# EasyEDA Pro project motorko_cryo_drake.eprj, schematic Schematic1

## Sheets
1 main: Board Name: Board1; Create Date: 2026-01-02; Page Name: main; Project Name: motorko_azure_dragon; Schematic Name: Schematic1; Update Date: 2026-01-03; Company: EasyEDA.com; Page Size: A4; Version: V1.0
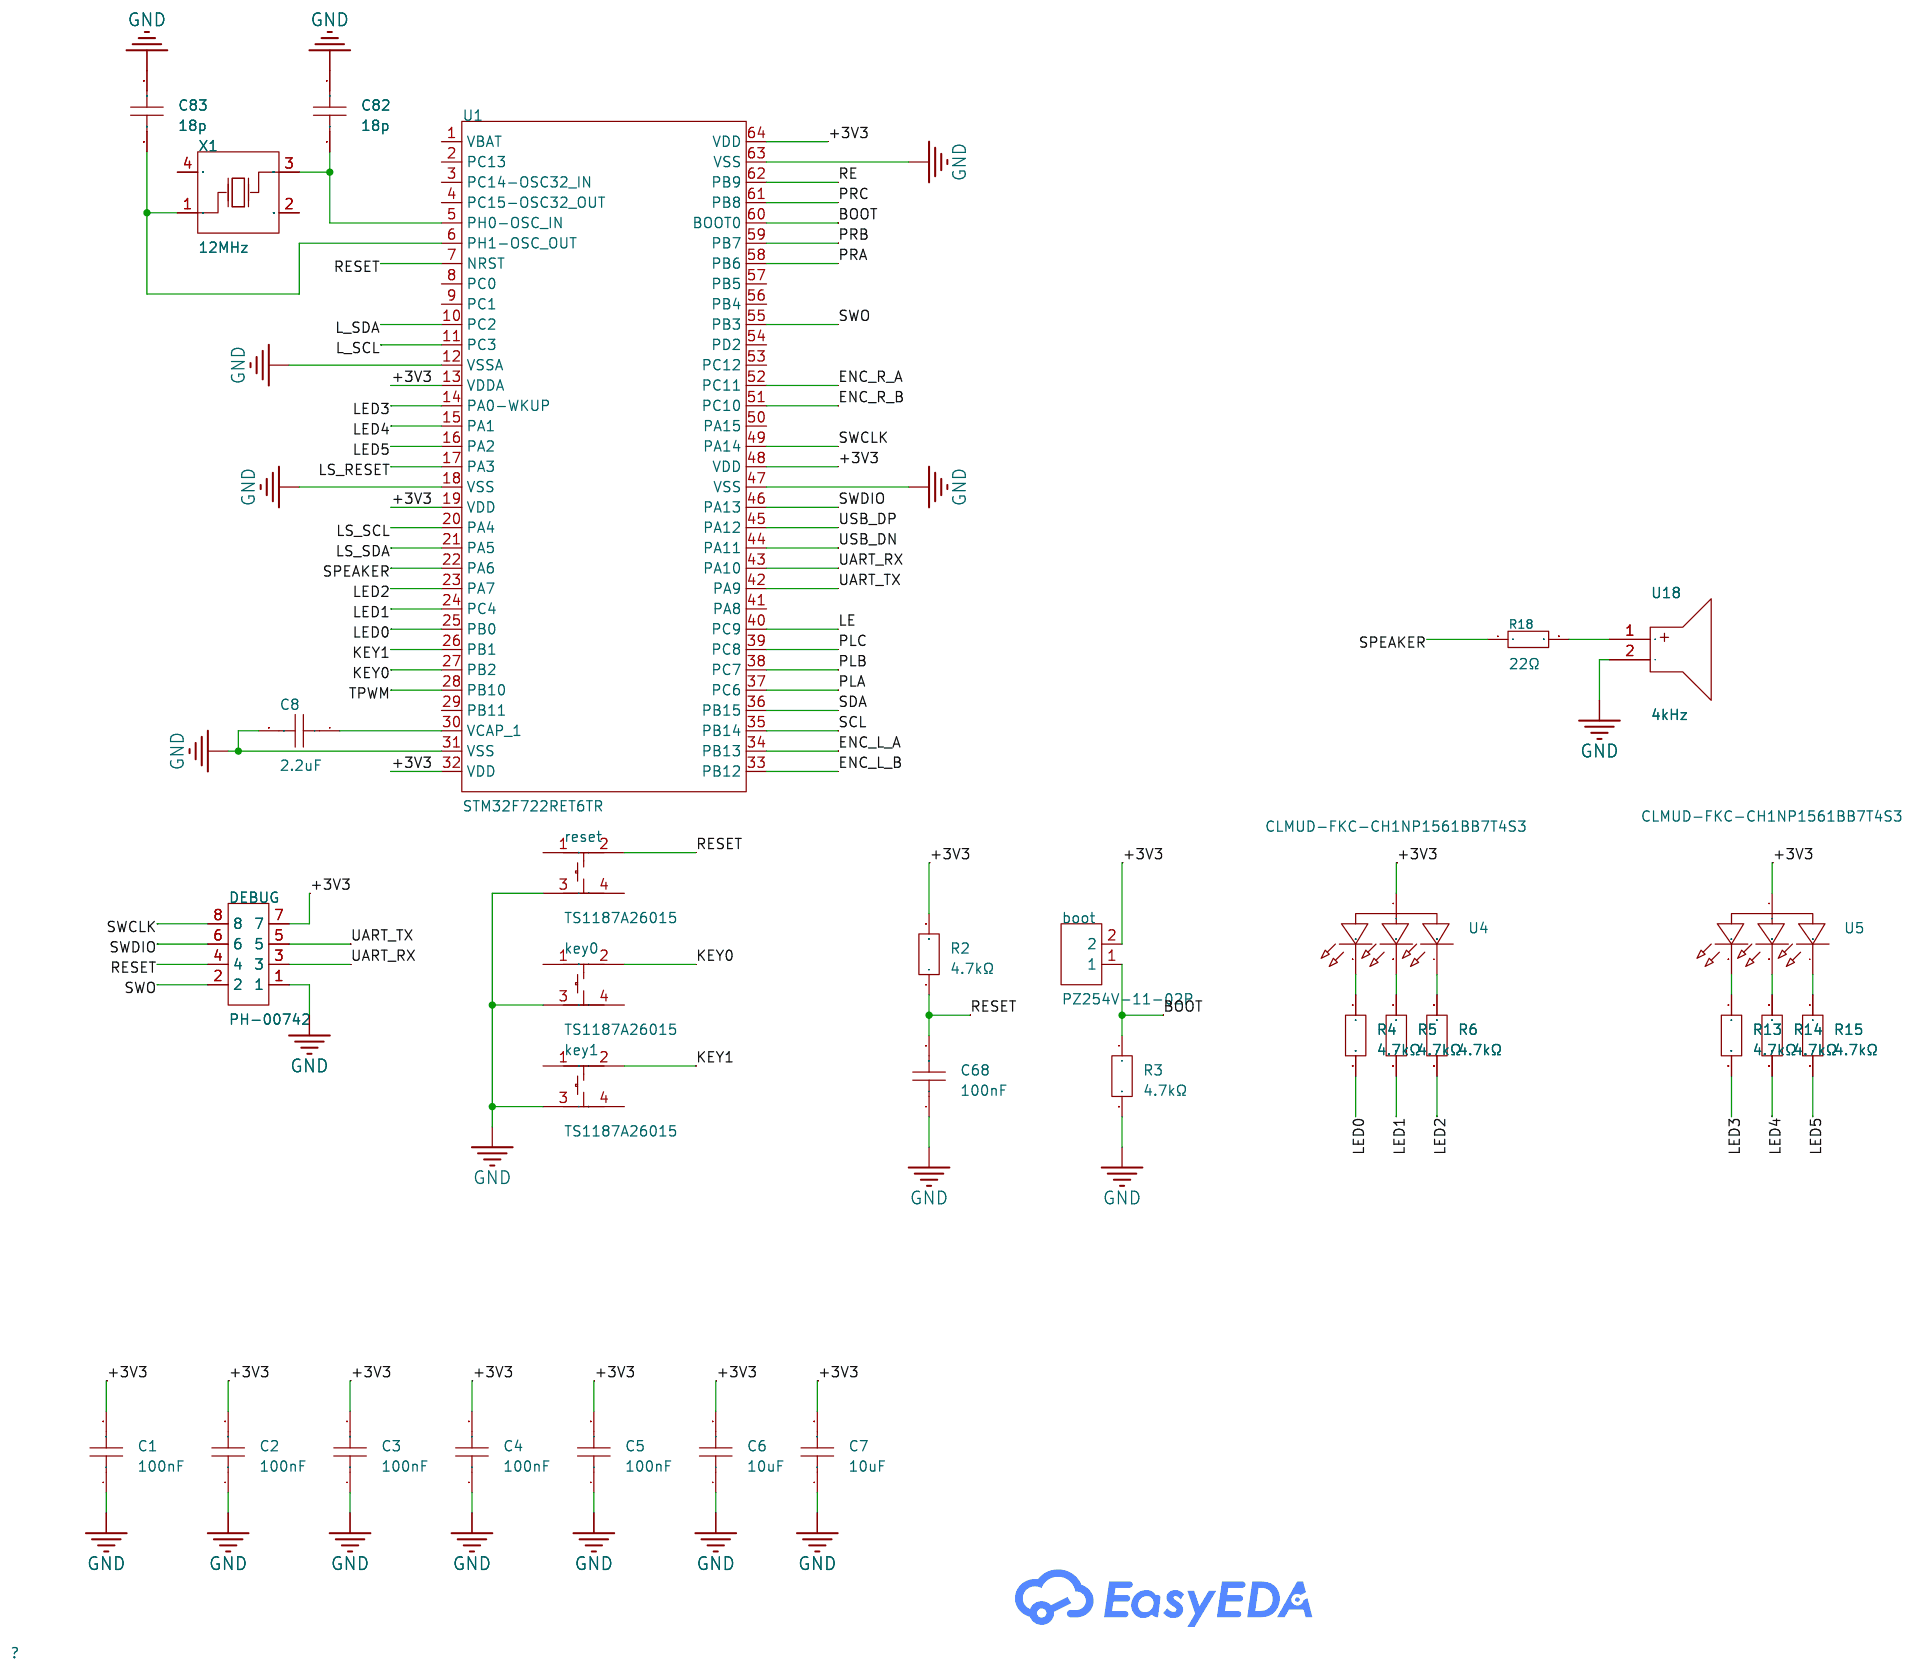
[diagram p0: main]
2 motors: Page Name: motors; Update Date: 2026-01-02
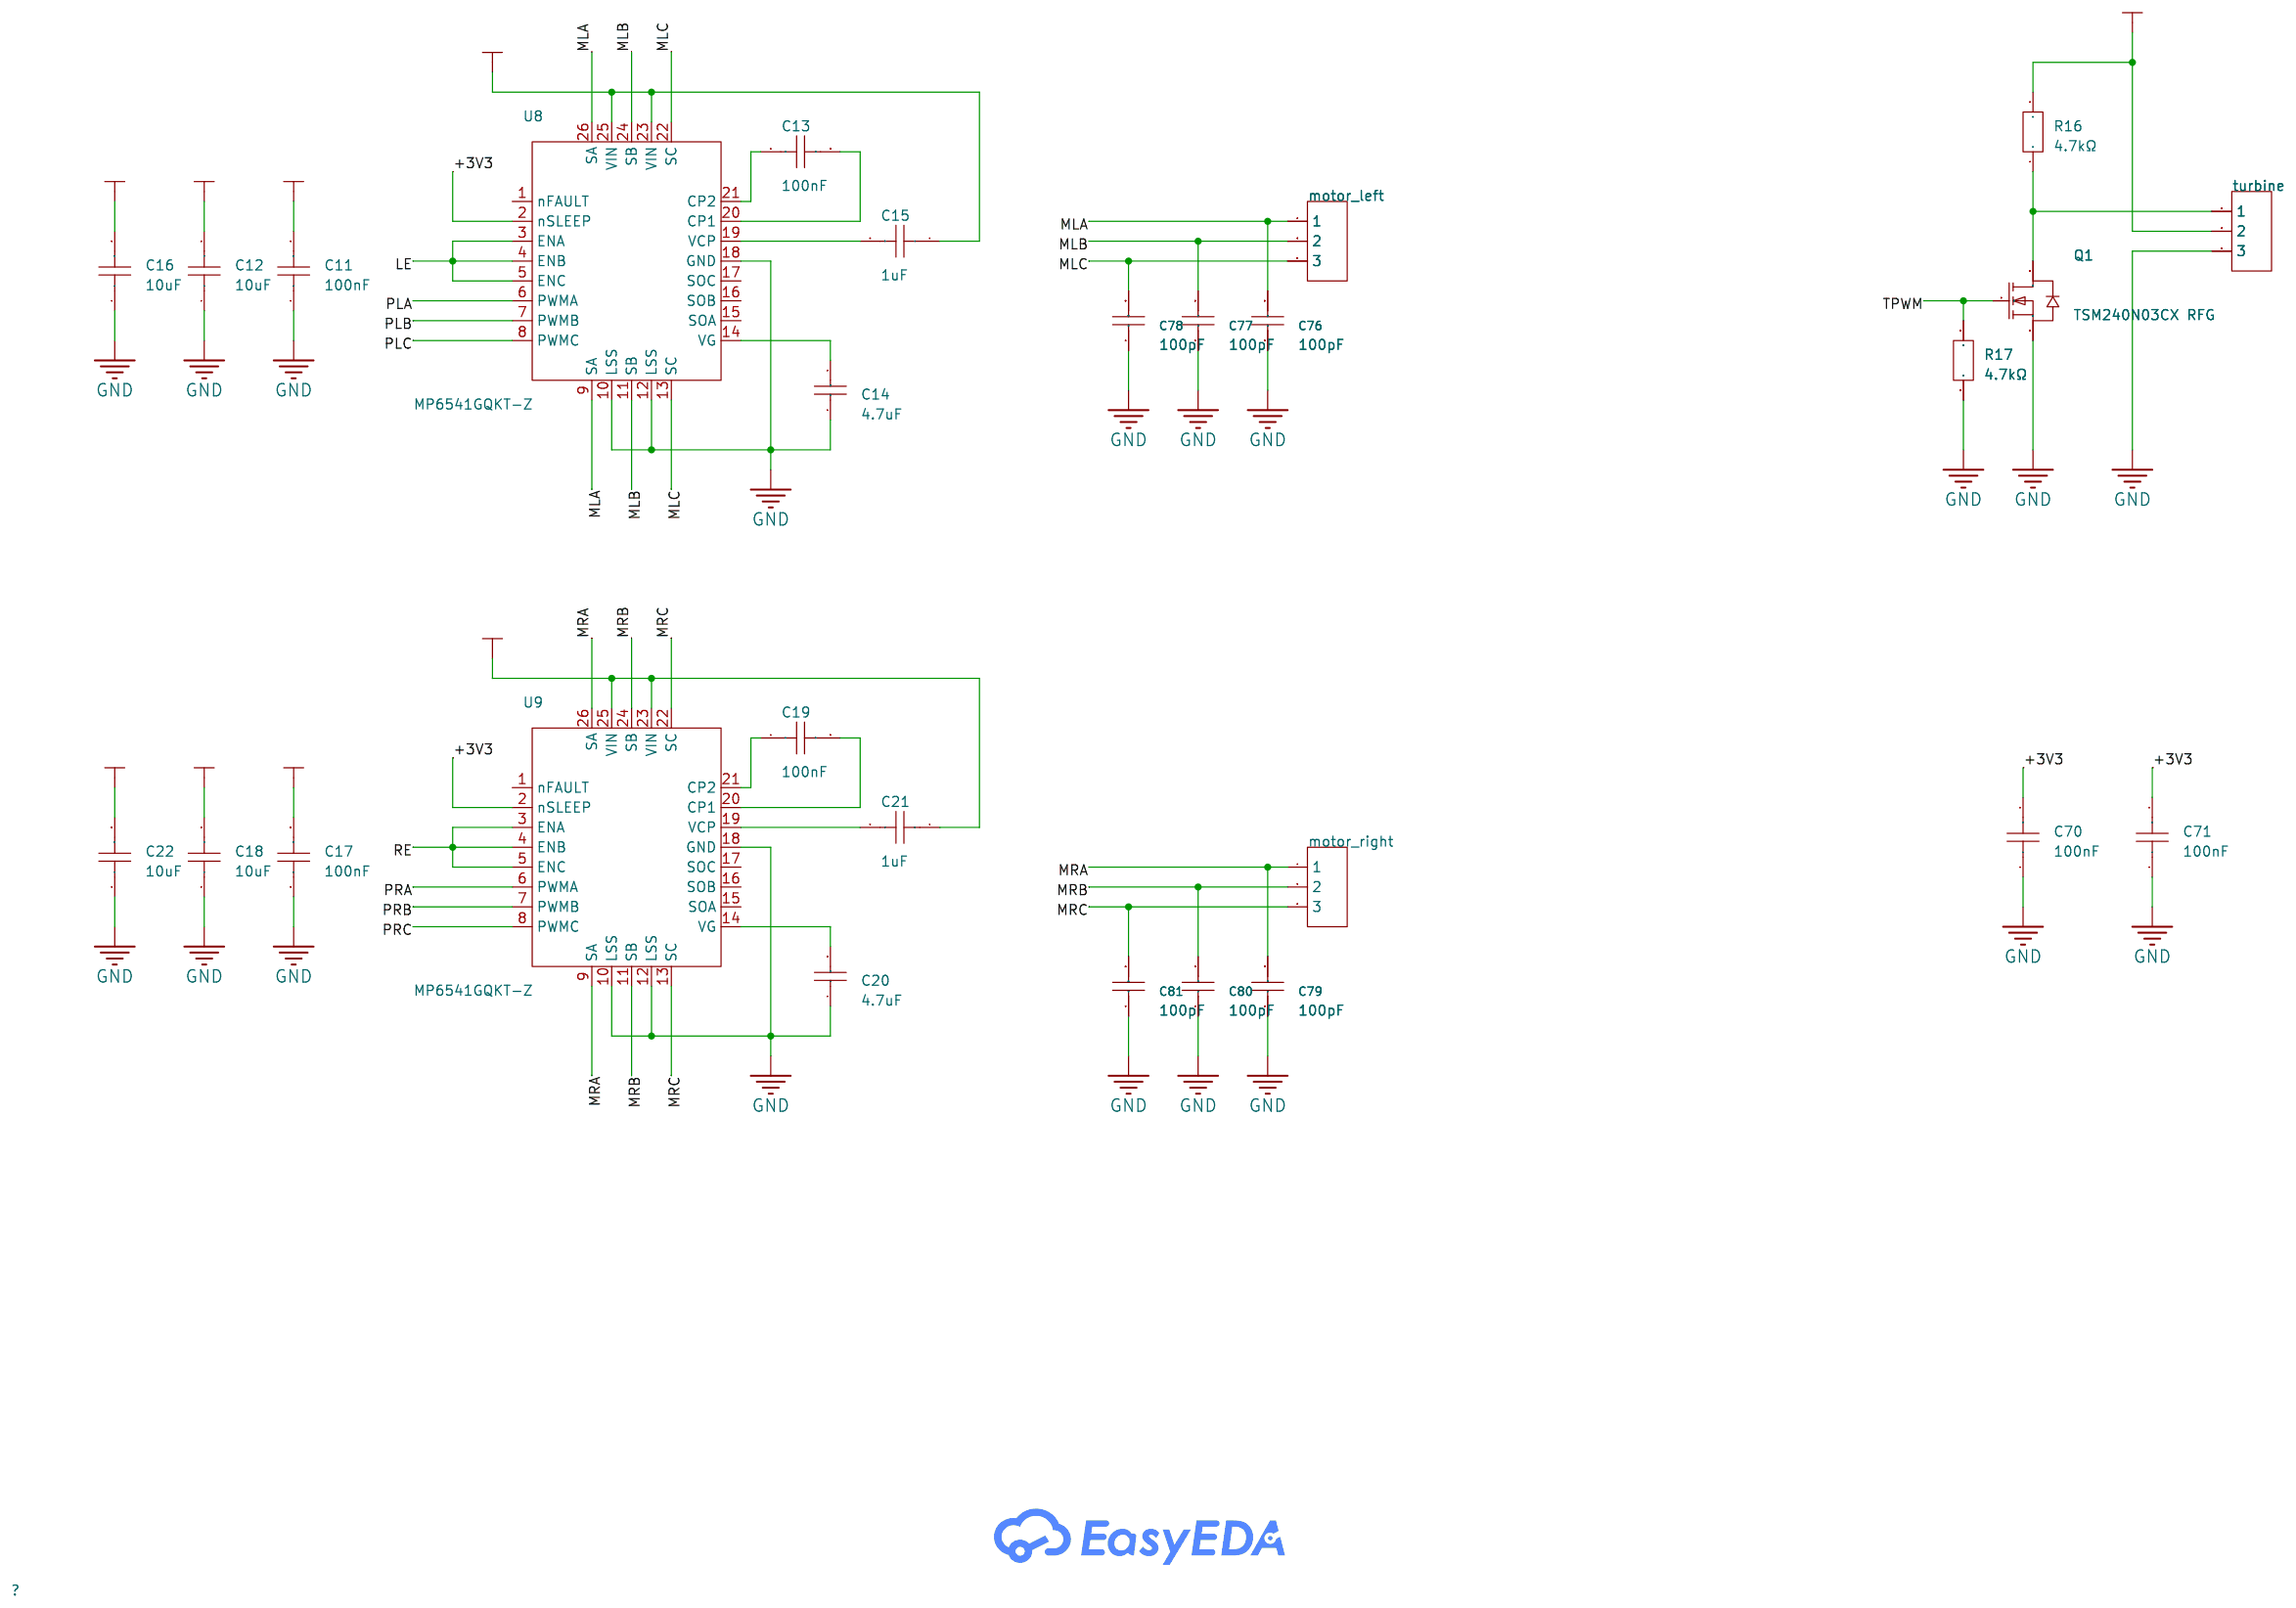
[diagram p1: motors]
3 power: Page Name: power
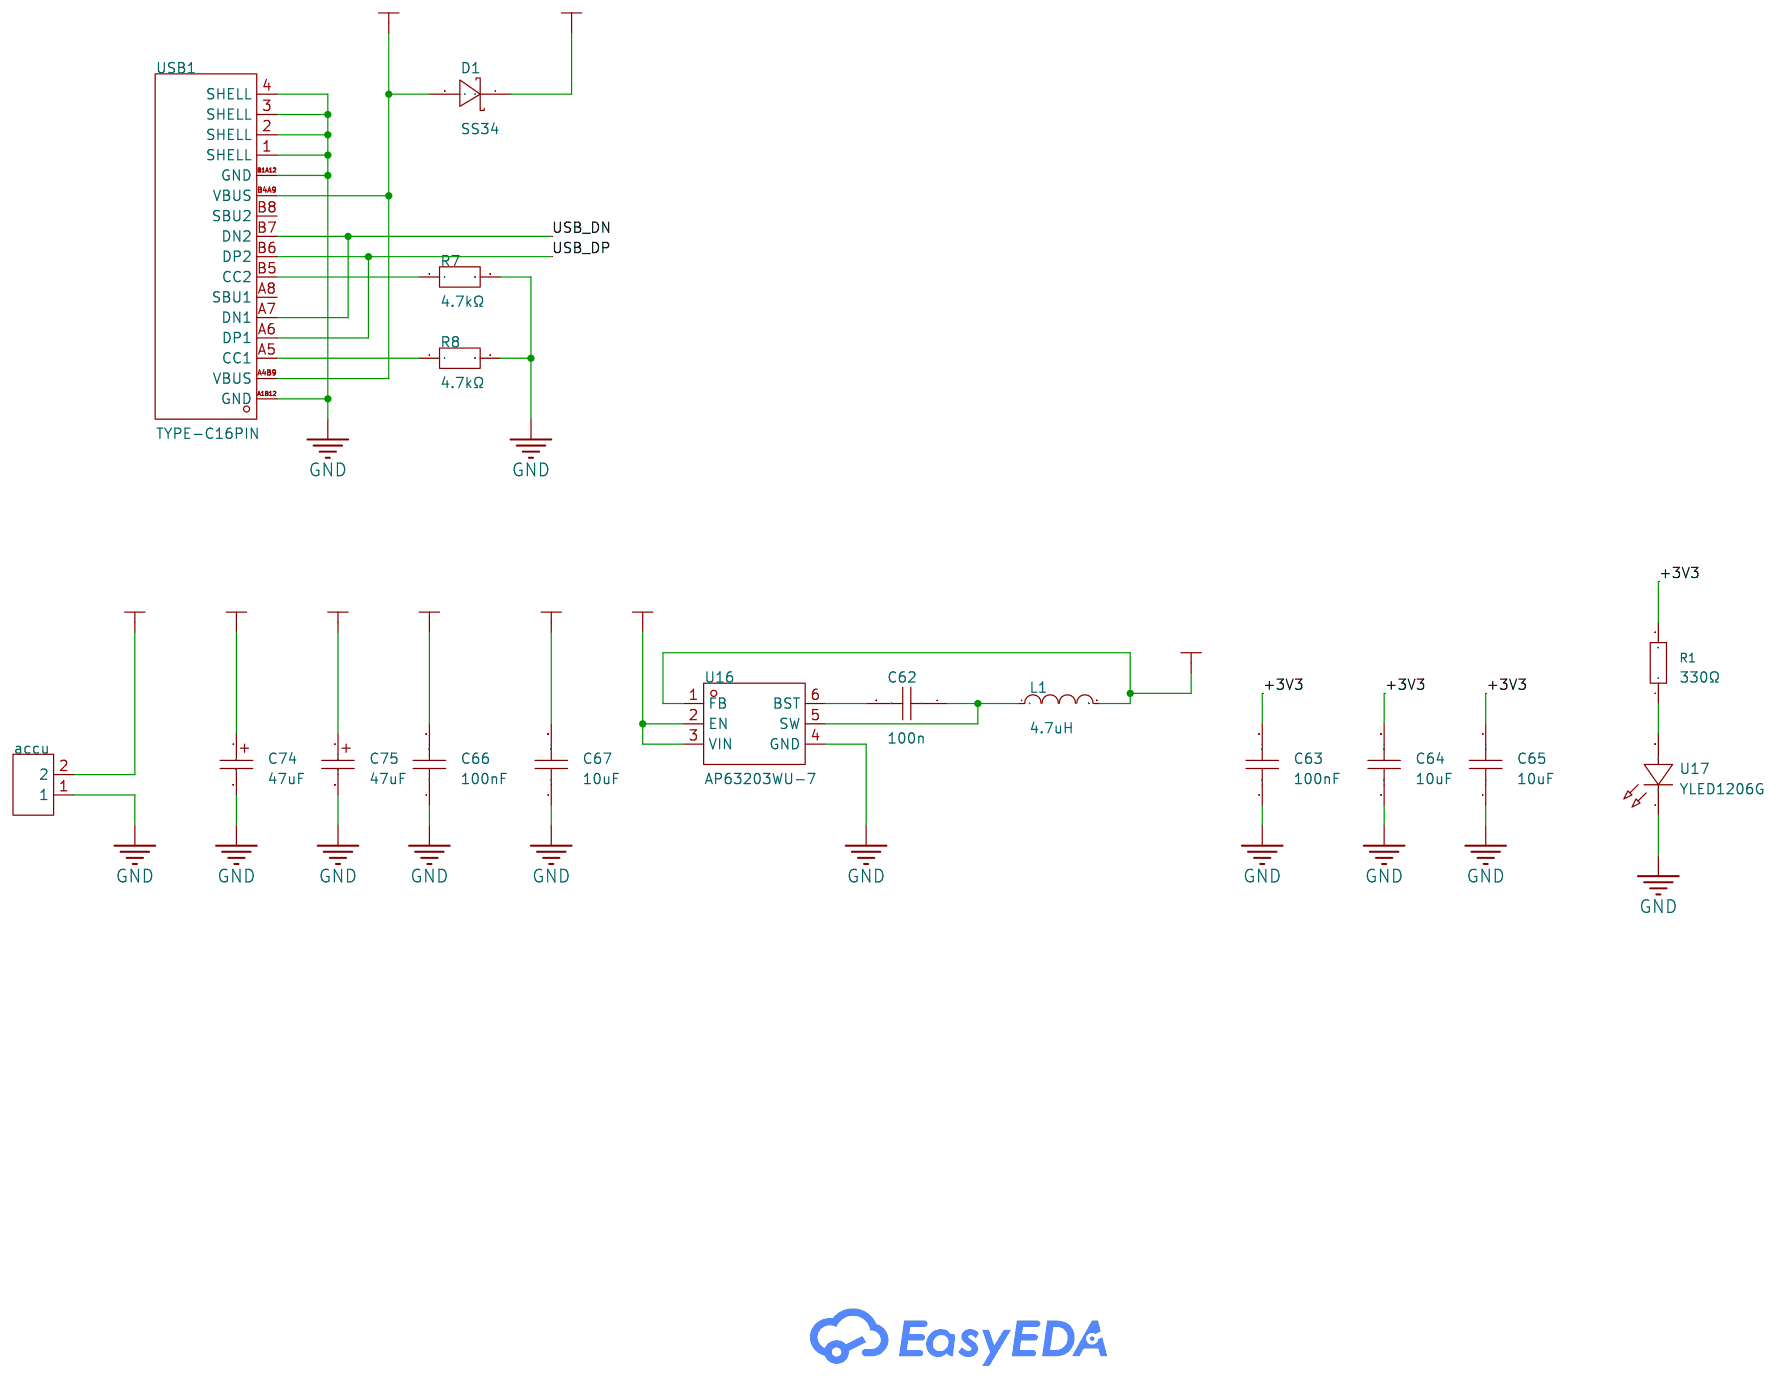
[diagram p2: power]
4 sensors: Create Date: 2026-01-03; Page Name: sensors
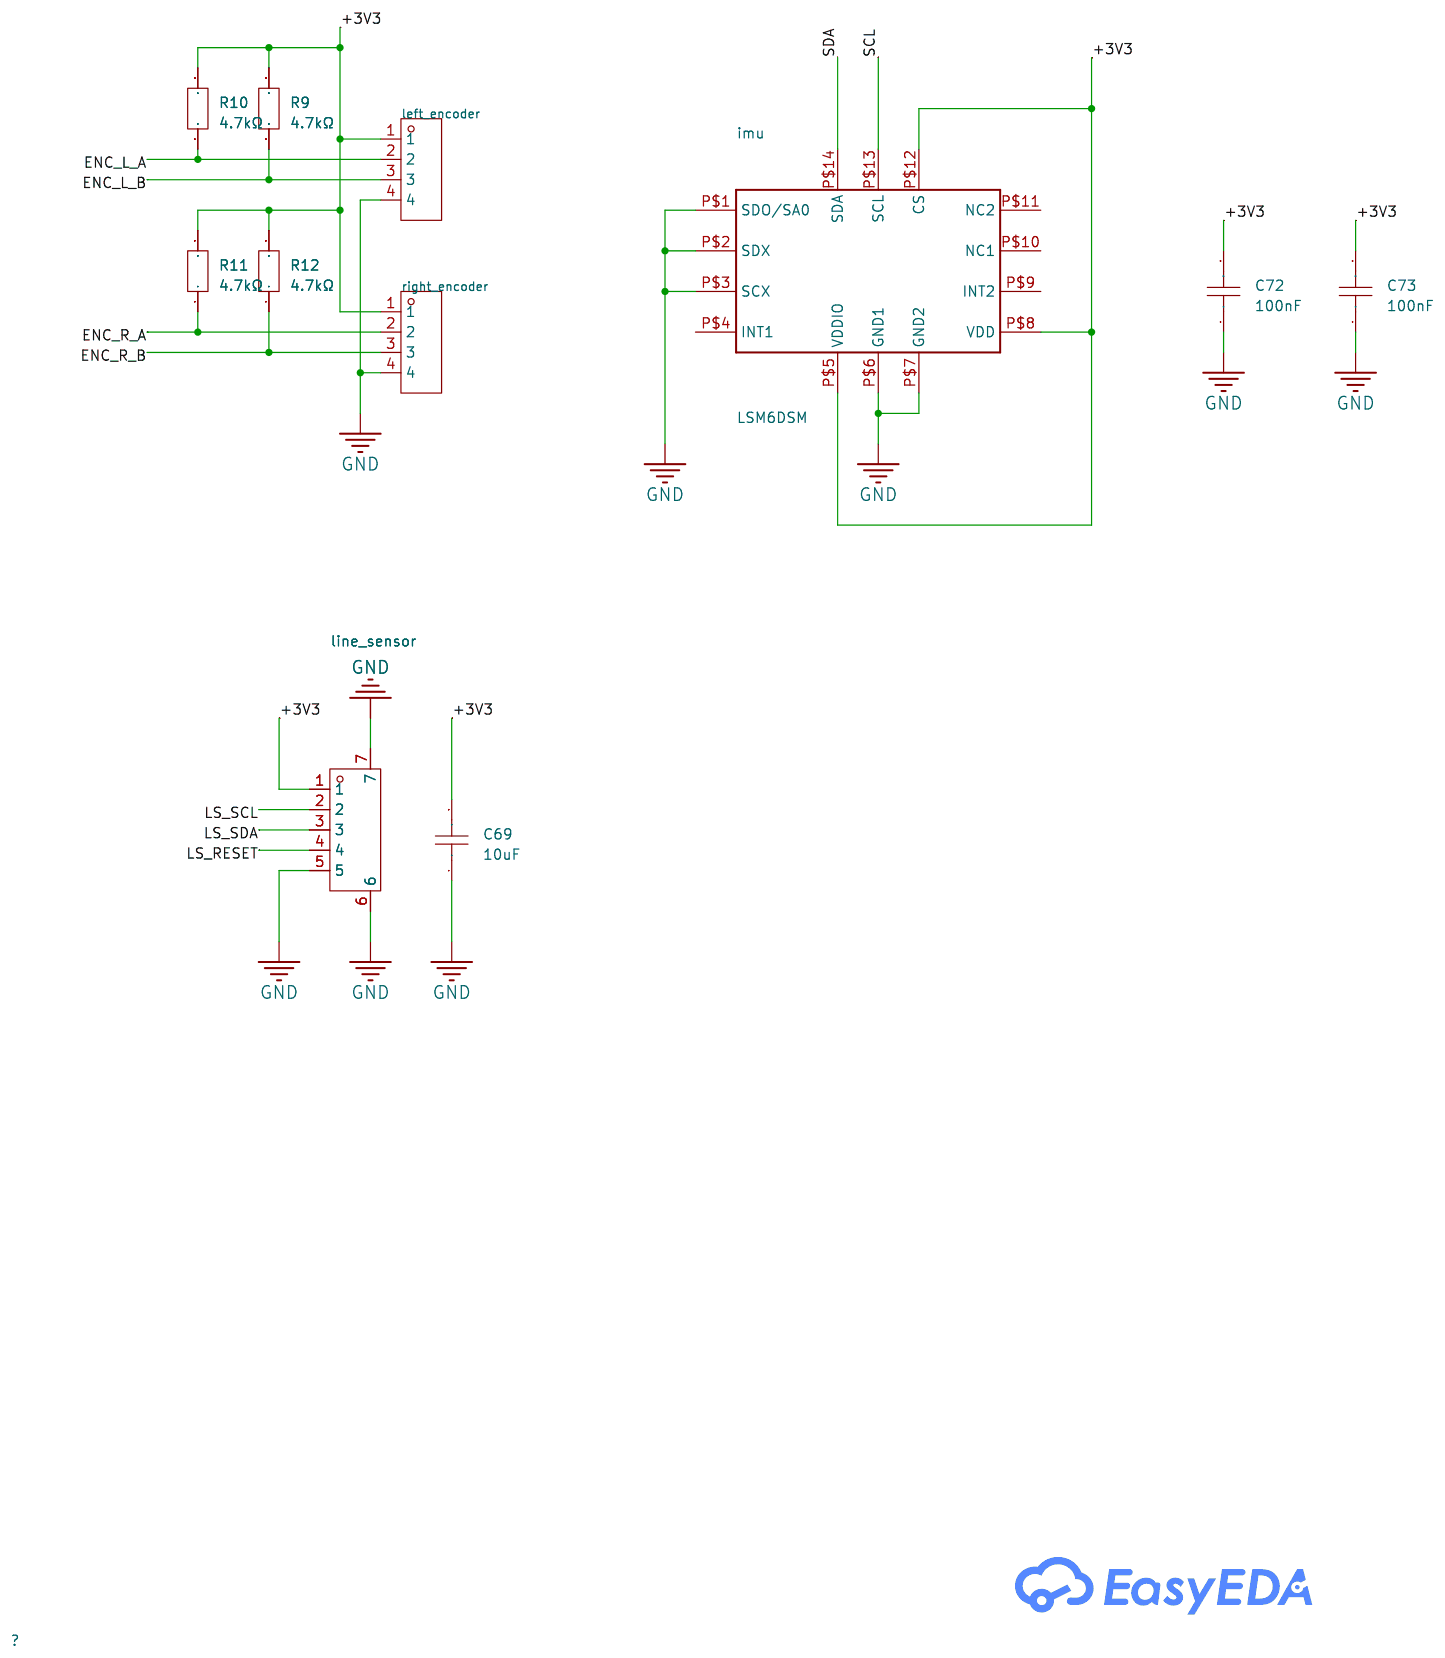
[diagram p3: sensors]

## Parts
sheet main
boot  PZ254V-11-02P  [HDR-TH_2P-P2.54-V-M]
C1  100nF  [C0805]
C2  100nF  [C0805]
C3  100nF  [C0805]
C4  100nF  [C0805]
C5  100nF  [C0805]
C6  10uF  [C0805]
C7  10uF  [C0805]
C8  2.2uF  [C0805]
C68  100nF  [C0805]
C82  18p  [C0805]
C83  18p  [C0805]
DEBUG  PH-00742  [HDR-TH_8P-P1.27-V-M-R2-C4-S1.27]
key0  TS1187A26015  [SW-SMD_4P-L5.1-W5.1-P3.70-LS6.5-TL_H1.5]
key1  TS1187A26015  [SW-SMD_4P-L5.1-W5.1-P3.70-LS6.5-TL_H1.5]
R2  4.7kΩ  [R0805]
R3  4.7kΩ  [R0805]
R4  4.7kΩ  [R0805]
R5  4.7kΩ  [R0805]
R6  4.7kΩ  [R0805]
R13  4.7kΩ  [R0805]
R14  4.7kΩ  [R0805]
R15  4.7kΩ  [R0805]
R18  22Ω  [R0805]
reset  TS1187A26015  [SW-SMD_4P-L5.1-W5.1-P3.70-LS6.5-TL_H1.5]
U1  STM32F722RET6TR  [LQFP-64_L10.0-W10.0-P0.50-LS12.0-BL]
U4  CLMUD-FKC-CH1NP1561BB7T4S3  [LED-SMD_4P-L1.5-W1.5_CLMUD-FKC-CH1NP1561BB7T4S3]
U5  CLMUD-FKC-CH1NP1561BB7T4S3  [LED-SMD_4P-L1.5-W1.5_CLMUD-FKC-CH1NP1561BB7T4S3]
U18  4kHz  [BUZ-SMD_L4.0-W4.0-P3.50-L]
X1  12MHz  [CRYSTAL-SMD_4P-L3.2-W2.5-BL]
sheet motors
C11  100nF  [C0805]
C12  10uF  [C0805]
C13  100nF  [C0805]
C14  4.7uF  [C0805]
C15  1uF  [C0805]
C16  10uF  [C0805]
C17  100nF  [C0805]
C18  10uF  [C0805]
C19  100nF  [C0805]
C20  4.7uF  [C0805]
C21  1uF  [C0805]
C22  10uF  [C0805]
C70  100nF  [C0805]
C71  100nF  [C0805]
C76  100pF  [C0805]
C77  100pF  [C0805]
C78  100pF  [C0805]
C79  100pF  [C0805]
C80  100pF  [C0805]
C81  100pF  [C0805]
motor_left  2.54-1*3P针  [HDR-TH_3P-P2.54-V-M-1]
motor_right  2.54-1*3P针  [HDR-TH_3P-P2.54-V-M-1]
Q1  TSM240N03CX RFG  [SOT-23-3_L2.9-W1.6-P1.90-LS2.8-BR]
R16  4.7kΩ  [R0805]
R17  4.7kΩ  [R0805]
turbine  2.54-1*3P针  [HDR-TH_3P-P2.54-V-M-1]
U8  MP6541GQKT-Z  [QFN-26_L6.0-W6.0-P0.65-TL_MP6541]
U9  MP6541GQKT-Z  [QFN-26_L6.0-W6.0-P0.65-TL_MP6541]
sheet power
accu  PZ254V-11-02P  [HDR-TH_2P-P2.54-V-M]
C62  100n  [C0805]
C63  100nF  [C0805]
C64  10uF  [C0805]
C65  10uF  [C0805]
C66  100nF  [C0805]
C67  10uF  [C0805]
C74  47uF  [CAP-SMD_L3.5-W2.8-R-RD]
C75  47uF  [CAP-SMD_L3.5-W2.8-R-RD]
D1  SS34  [SMA_L4.3-W2.6-LS5.2-RD]
L1  4.7uH  [IND-SMD_L4.0-W4.0_FNR40XXS]
R1  330Ω  [R0805]
R7  4.7kΩ  [R0805]
R8  4.7kΩ  [R0805]
U16  AP63203WU-7  [TSOT-26_L2.9-W1.6-P0.95-LS2.8-BL]
U17  YLED1206G  [LED1206-RD]
USB1  TYPE-C16PIN  [USB-C-SMD_TYPE-C16PIN]
sheet sensors
C69  10uF  [C0805]
C72  100nF  [C0805]
C73  100nF  [C0805]
imu  LSM6DSM  [LGA14L]
left_encoder  PZ254V-11-04P  [HDR-TH_4P-P2.54-V-M]
line_sensor  GT-F0509SR15-05SMT01  [CONN-SMD_GT-F0509SR15-05SMT01]
R9  4.7kΩ  [R0805]
R10  4.7kΩ  [R0805]
R11  4.7kΩ  [R0805]
R12  4.7kΩ  [R0805]
right_encoder  PZ254V-11-04P  [HDR-TH_4P-P2.54-V-M]

## Library data of the parts
accu boot = PZ254V-11-02P: LCSC Part Name: 1x2P 间距:2.54mm 方针 直插; Supplier Part: C492401; Manufacturer: XFCN(兴飞); Supplier Footprint: 插件,P=2.54mm; JLCPCB Part Class: Extended Part; Datasheet: https://item.szlcsc.com/datasheet/PZ254V-11-02P/502957.html; Supplier: LCSC; Pin Structure: 1x2P; Pitch: 2.54mm; Circluar Pins/Square Pins: Pin Header; Mounting Type: Through Hole; Number of Rows: 1; Number of Pins: 2P; Length of Mating Pin: 6mm; Insulation Height: 2.5mm; Length of End Connection Pin: 3mm; Contact Material: Brass; Operating Temperature: -40℃~+105℃; Color: Black
C1-C5 C11 C13 C17 C19 C63 C66 C68 C70-C73 = CC0805KRX7R9BB104: LCSC Part Name: 100nF ±10% 50V; Supplier Part: C49678; Manufacturer: YAGEO(国巨); Supplier Footprint: 0805; JLCPCB Part Class: Basic Part; Datasheet: https://item.szlcsc.com/datasheet/CC0805KRX7R9BB104/50686.html; Supplier: LCSC; Tolerance: ±10%; Voltage Rating: 50V; Temperature Coefficient: X7R
C6 C7 C12 C16 C18 C22 C64 C65 C67 C69 = GRM21BR61H106KE43L: LCSC Part Name: 10uF ±10% 50V; Supplier Part: C440198; Manufacturer: muRata(村田); Supplier Footprint: 0805; JLCPCB Part Class: Basic Part; Datasheet: https://item.szlcsc.com/datasheet/GRM21BR61H106KE43L/439567.html; Supplier: LCSC; Tolerance: ±10%; Voltage Rating: 50V; Temperature Coefficient: X5R
C8 C82 C83 = CL21A225KBQNNNE: LCSC Part Name: 2.2uF ±10% 50V; Supplier Part: C377773; Manufacturer: SAMSUNG(三星); Supplier Footprint: 0805; JLCPCB Part Class: Basic Part; Datasheet: https://item.szlcsc.com/datasheet/CL21A225KBQNNNE/350246.html; Supplier: LCSC; Tolerance: ±10%; Voltage Rating: 50V; Temperature Coefficient: X5R
DEBUG = PH-00742: LCSC Part Name: 2x4P 间距:1.27mm 方针 直插; Supplier Part: C2685182; Manufacturer: Liansheng(连盛); Supplier Footprint: 插件,P=1.27mm; JLCPCB Part Class: Extended Part; Datasheet: https://item.szlcsc.com/datasheet/PH-00742/2784456.html; Supplier: LCSC; Pin Structure: 2x4P; Pitch: 1.27mm; Row Spacing: 1.27mm; Circluar Pins/Square Pins: Pin Header; Mounting Type: Through Hole; Number of Rows: 2; Number of Pins: 8P; Current Rating: 1A; Length of Mating Pin: 3mm; Insulation Height: 2mm; Length of End Connection Pin: 2mm; Operating Temperature: -40℃~+105℃; Color: Black
key0 key1 reset = TS1187A26015: Supplier Part: C7471807; Manufacturer: HanElectricity(瀚源); JLCPCB Part Class: Extended Part; Datasheet: https://item.szlcsc.com/datasheet/TS1187A26015/8527877.html; Supplier: LCSC
R2-R17 = FRC0805J472 TS: LCSC Part Name: 4.7kΩ ±5% 125mW 厚膜电阻; Supplier Part: C2907326; Manufacturer: FOJAN(富捷); Supplier Footprint: 0805; JLCPCB Part Class: Extended Part; Supplier: LCSC; Type: Thick Film Resistor; Tolerance: ±5%; Power(Watts): 125mW; Voltage-Supply(Max): 150V; Temperature Coefficient: ±100ppm/℃; Operating Temperature: -55℃~+155℃
R18 = 0805W8J0220T5E: LCSC Part Name: 22Ω ±5% 125mW 厚膜电阻; Supplier Part: C25295; Manufacturer: UNI-ROYAL(厚声); Supplier Footprint: 0805; JLCPCB Part Class: Extended Part; Datasheet: https://item.szlcsc.com/datasheet/0805W8J0220T5E/26038.html; Supplier: LCSC; Type: Thick Film Resistor; Tolerance: ±5%; Power(Watts): 125mW; Voltage-Supply(Max): 150V; Temperature Coefficient: ±200ppm/℃; Operating Temperature: -55℃~+155℃
U1 = STM32F722RET6TR: LCSC Part Name: 带DSP和FPU的高性能ARM Cortex-M7 MCU，具有512 KB Flash、216 MHz CPU、ART加速器、一级缓存和SDRAM; Supplier Part: C3230927; Manufacturer: ST(意法半导体); Supplier Footprint: LQFP-64(10x10); JLCPCB Part Class: Extended Part; Datasheet: https://atta.szlcsc.com/upload/public/pdf/source/20221107/A1E77E60094A628874AD1229AC7C6782.pdf; Supplier: LCSC; CPU Maximum Speed: 216MHz; Program Storage Size: 512KB; Number of I/O: 50; ADC (Bit): 12bit; DAC (Bit): 12bit; Low Voltage Detection Threshold: 1.7V~3.6V
U4 U5 = CLMUD-FKC-CH1NP1561BB7T4S3: Supplier Part: C6484743; Manufacturer: CREE LED; Supplier Footprint: PLCC-4; JLCPCB Part Class: Extended Part; Datasheet: https://item.szlcsc.com/datasheet/CLMUD-FKC-CH1NP1561BB7T4S3/7437925.html; Supplier: LCSC; Diode Configuration: Common Anode
U18 = SMT-0440-T-2-R: Supplier Part: C3812299; Manufacturer: PUIAUDIO; JLCPCB Part Class: Extended Part; Datasheet: https://atta.szlcsc.com/upload/public/pdf/source/20241031/3B64AF0C1EA612B98213C115B04DBAA8.pdf; Supplier: LCSC; Driver Circuitry: Passive (external drive); Technology: Electromagnetic Type; Voltage - Supply: 2V~4V; Sound Pressure Level(SPL): 70dB; Length: 4mm; Width: 4mm; Height: 2.5mm; Operating Temperature: -20℃~+70℃
X1 = X322512MSB4SI: LCSC Part Name: YSX321SL 12MHZ 4P 3225 20PF ±10PPM -40~85℃ (±20PPM); Supplier Part: C9002; Manufacturer: YXC(扬兴晶振); Supplier Footprint: SMD3225-4P; JLCPCB Part Class: Basic Part; Datasheet: https://item.szlcsc.com/datasheet/X322512MSB4SI/9522.html; Supplier: LCSC; Type: Crystal Oscillator; Normal temperature Frequency Tolerance: ±10ppm; Load Capacitance: 20pF; Frequency Stability: ±20ppm; Operating Temperature: -40℃~+85℃
C14 C20 = CL21A475KAQNNNE: LCSC Part Name: 4.7uF ±10% 25V; Supplier Part: C1779; Manufacturer: SAMSUNG(三星); Supplier Footprint: 0805; JLCPCB Part Class: Basic Part; Datasheet: https://item.szlcsc.com/datasheet/CL21A475KAQNNNE/2131.html; Supplier: LCSC; Tolerance: ±10%; Voltage Rating: 25V; Temperature Coefficient: X5R
C15 C21 = TCC0805X7R105M500FT: LCSC Part Name: 1uF ±20% 50V; Supplier Part: C376929; Manufacturer: CCTC(三环); Supplier Footprint: 0805; JLCPCB Part Class: Extended Part; Datasheet: https://item.szlcsc.com/datasheet/TCC0805X7R105M500FT/349288.html; Supplier: LCSC; Tolerance: ±20%; Voltage Rating: 50V; Temperature Coefficient: X7R
C76-C81 = CL21C101JBANNNC: LCSC Part Name: 100pF ±5% 50V; Supplier Part: C1790; Manufacturer: SAMSUNG(三星); Supplier Footprint: 0805; JLCPCB Part Class: Basic Part; Datasheet: https://item.szlcsc.com/datasheet/CL21C101JBANNNC/2142.html; Supplier: LCSC; Tolerance: ±5%; Voltage Rating: 50V; Temperature Coefficient: C0G
motor_left motor_right turbine = 2.54-1*3P针: LCSC Part Name: 1x3P 间距:2.54mm 方针 直插; Supplier Part: C49257; Manufacturer: BOOMELE(博穆精密); Supplier Footprint: 插件,P=2.54mm; JLCPCB Part Class: Extended Part; Datasheet: https://item.szlcsc.com/datasheet/2.54-1*3P%25E9%2592%2588/50265.html; Supplier: LCSC; Pin Structure: 1x3P; Pitch: 2.54mm; Circluar Pins/Square Pins: Pin Header; Mounting Type: Through Hole; Number of Rows: 1; Number of Pins: 3P; Current Rating: 3A; Length of Mating Pin: 6mm; Insulation Height: 2.5mm; Length of End Connection Pin: 3mm; Contact Material: Brass; Contact Plating: Gold; Operating Temperature: -40℃~+105℃; Color: Black
Q1 = TSM240N03CX RFG: LCSC Part Name: 1个N沟道 耐压:30V 电流:6.5A; Supplier Part: C410829; Manufacturer: Taiwan Semiconductor(台湾半导体); Supplier Footprint: SOT-23; JLCPCB Part Class: Extended Part; Datasheet: https://atta.szlcsc.com/upload/public/pdf/source/20190812/C410829_433070223544871191517093BF0ECF20.pdf; Supplier: LCSC; Type: 1个NChannel; Drain Source On Resistance (RDS(on)@Vgs,Id): 24mΩ@10V,6A; Gate Threshold Voltage (Vgs(th)@Id): 2.5V@250uA; Total Gate Charge (Qg@Vgs): 4.1nC@4.5V; Input Capacitance (Ciss@Vds): 345pF@25V
U8 U9 = MP6541GQKT-Z: LCSC Part Name: 40V、8A三相功率级; Supplier Part: C19089145; Manufacturer: MPS(芯源); Supplier Footprint: TQFN-26(6x6); JLCPCB Part Class: Extended Part; Datasheet: https://item.szlcsc.com/datasheet/MP6541GQKT-Z/20295232.html; Supplier: LCSC; Drive Type: Three Phase; Integrated FETs: Yes; Number of Half Bridges: 3; Output Current: 8A; Peak Current: 12A; Voltage - Supply: 4.75V~40V; Quiescent Current(Iq): 4mA; Operating Temperature: -40℃~+125℃
C62 = CL21A106KAYNNNE_C15850: Capacitance:10uF Tolerance:±10% Tolerance:±10% Voltage Rating:25V Temperature Coefficient:X5R; LCSC Part Name: 10uF ±10% 25V; Supplier Part: C15850; Manufacturer: SAMSUNG(三星); Manufacturer Part: CL21A106KAYNNNE; Supplier Footprint: 0805; JLCPCB Part Class: Basic Part; Datasheet: https://item.szlcsc.com/datasheet/CL21A106KAYNNNE/16532.html; Supplier: LCSC; Tolerance: ±10%; Voltage Rating: 25V; Temperature Coefficient: X5R
C74 C75 = CA45-B010K476T: LCSC Part Name: 47uF ±10% 10V; Supplier Part: C123253; Manufacturer: 湘怡中元/湘江; Supplier Footprint: CASE-B-3528-19(mm); JLCPCB Part Class: Extended Part; Datasheet: https://item.szlcsc.com/datasheet/CA45-B010K476T/124523.html; Supplier: LCSC; Tolerance: ±10%; Voltage Rating: 10V; Equivalent Series Resistance(ESR): 1Ω@100kHz; Operating Temperature: -55℃~+125℃
D1 = SS34_C8678: LCSC Part Name: 电压:40V 电流:3A; Supplier Part: C8678; Manufacturer: MDD(辰达半导体); Supplier Footprint: SMA(DO-214AC); JLCPCB Part Class: Basic Part; Datasheet: https://item.szlcsc.com/datasheet/SS34/9178.html; Supplier: LCSC; Diode Configuration: Independent; Voltage - Forward(Vf@If): 550mV@3A; Voltage - DC Reverse(Vr): 40V; Current - Rectified: 3A; Reverse Leakage Current (Ir): 500uA@40V; Operating Junction Temperature Range: -55℃~+125℃
L1 = FNR4030S4R7MT: Inductance:4.7uH Tolerance:±20% Tolerance:±20% Current Rating:2.3A Current - Saturation(Isat):3.2A DC Resistance(DCR):78mΩ Type:Magnetic Core Shielded Winding Alloy Inductor; LCSC Part Name: 4.7uH ±20% 3.2A; Supplier Part: C167874; Manufacturer: cjiang(长江微电); Supplier Footprint: SMD,4x4mm; JLCPCB Part Class: Extended Part; Datasheet: https://atta.szlcsc.com/upload/public/pdf/source/20190327/C167925_9EFF0AABC4CA629C2CC95961DBF7D39D.pdf; Supplier: LCSC; Tolerance: ±20%; Current Rating: 2.3A; Current - Saturation(Isat): 3.2A; DC Resistance(DCR): 78mΩ; Type: Magnetic Core Shielded Winding Alloy Inductor
R1 = 0805W8F3300T5E: LCSC Part Name: 330Ω ±1% 125mW 厚膜电阻; Supplier Part: C17630; Manufacturer: UNI-ROYAL(厚声); Supplier Footprint: 0805; JLCPCB Part Class: Basic Part; Datasheet: https://item.szlcsc.com/datasheet/0805W8F3300T5E/18318.html; Supplier: LCSC; Type: Thick Film Resistor; Tolerance: ±1%; Power(Watts): 125mW; Voltage-Supply(Max): 150V; Temperature Coefficient: ±100ppm/℃; Operating Temperature: -55℃~+155℃
U16 = AP63203WU-7: Function:Buck Voltage - Supply:3.8V~32V Voltage - Supply:3.8V~32V Output Voltage:3.3V Output Voltage:3.3V Output Current:2A Frequency - Switching:1.1MHz Frequency - Switching:1.1MHz Operating Temperature:-40℃~+85℃@(TA) Operating Temperature:-40℃~+85℃@(TA); LCSC Part Name: 3.8V至32V输入、2A低静态电流同步降压转换器，增强EMI抑制; Supplier Part: C780769; Manufacturer: DIODES(美台); Supplier Footprint: TSOT-23-6; JLCPCB Part Class: Extended Part; Datasheet: https://item.szlcsc.com/datasheet/AP63203WU-7/832852.html; Supplier: LCSC; Function: Buck; Voltage - Supply: 3.8V~32V; Output Voltage: 3.3V; Output Current: 2A; Frequency - Switching: 1.1MHz; Operating Temperature: -40℃~+85℃@(TA); Synchronous Rectifier: Yes; Number of Outputs: 1; Topology: Buck; Quiescent Current: 22uA; Switch tube (built-in/external): Built-In; Output Type: Fixed
U17 = YLED1206G: LCSC Part Name: 发光管; Supplier Part: C30584801; Manufacturer: YONGYUTAI(永裕泰); Supplier Footprint: 1206; JLCPCB Part Class: Extended Part; Datasheet: https://item.szlcsc.com/datasheet/YLED1206G/32319013.html; Supplier: LCSC; Illumination Color: Emerald Green; Voltage - Forward(Vf): 2.4V~3.1V; Power(Watts): 100mW; Forward Current: 20mA; Wavelength - Dominant: 516nm~531nm; Peak Wavelength: 525nm; Luminous Intensity: 620mcd; Viewing Angle: 120°; Operating Temperature: -40℃~+85℃
USB1 = TYPE-C16PIN: LCSC Part Name: Type-C 母 卧贴; Supplier Part: C393939; Manufacturer: SHOU HAN(首韩); Supplier Footprint: SMD; JLCPCB Part Class: Extended Part; Datasheet: https://item.szlcsc.com/datasheet/TYPE-C16PIN/372551.html; Supplier: LCSC; Connector Type: Type-C; Protocol Standard: USB 3.1; Gender: Female; Mounting Type: Surface Mount, Right Angle; Number of Contacts: 16P; Number of Ports: 1; Current Rating-Power: 3A; Voltage Rating: 30V; Connect-Disconnect Life: 10,000 Cycles; Detection color: Black; Operating Temperature: -40℃~+85℃
imu = LSM6DSM
left_encoder right_encoder = PZ254V-11-04P: LCSC Part Name: 1x4P 间距:2.54mm 方针 直插; Supplier Part: C2691448; Manufacturer: XFCN(兴飞); Supplier Footprint: 插件,P=2.54mm; JLCPCB Part Class: Extended Part; Datasheet: https://item.szlcsc.com/datasheet/PZ254V-11-04P/2801085.html; Supplier: LCSC; Pin Structure: 1x4P; Pitch: 2.54mm; Circluar Pins/Square Pins: Pin Header; Mounting Type: Through Hole; Number of Rows: 1; Number of Pins: 4P; Current Rating: 3A; Voltage Rating (Max): 250V; Length of Mating Pin: 6mm; Insulation Height: 2.5mm; Length of End Connection Pin: 3mm; Operating Temperature: -40℃~+105℃; Color: Black
line_sensor = GT-F0509SR15-05SMT01: LCSC Part Name: 翻盖式 下接 P数:5P 间距:0.5mm; Supplier Part: C21882317; Manufacturer: G-Switch(品赞); Supplier Footprint: SMD,P=0.5mm,卧贴; JLCPCB Part Class: Extended Part; Datasheet: https://item.szlcsc.com/datasheet/GT-F0509SR15-05SMT01/23309883.html; Supplier: LCSC; Locking Feature: Hinged Lid; Contact Type: Bottom Contact; Number of Contacts: 5P; Pitch: 0.5mm; Mounting Type: Surface Mount, Right Angle; FFC, FCB Thickness: 0.3mm; Height Above Board: 1.53mm; Contact Material: Phosphor Bronze; Contact Plating: Tin; Operating Temperature: -25℃~+85℃

## Nets
+3V3: boot.2 C1.2 C2.2 C3.2 C4.2 C5.2 C6.2 C7.2 C63.2 C64.2 C65.2 C69.2 C70.2 C71.2 C72.2 C73.2 DEBUG.7 imu.P$5(VDDIO) imu.P$8(VDD) imu.P$12(CS) L1.2 left_encoder.1 line_sensor.1 R1.2 R2.2 R9.2 R10.2 R11.2 R12.2 right_encoder.1 U1.13(VDDA) U1.19(VDD) U1.32(VDD) U1.48(VDD) U1.64(VDD) U4.1(A) U5.1(A) U8.2(nSLEEP) U9.2(nSLEEP) U16.1(FB)
GND: accu.1 C1.1 C2.1 C3.1 C4.1 C5.1 C6.1 C7.1 C8.2 C11.1 C12.1 C14.1 C16.1 C17.1 C18.1 C20.1 C22.1 C63.1 C64.1 C65.1 C66.1 C67.1 C68.1 C69.1 C70.1 C71.1 C72.1 C73.1 C74.2 C75.2 C76.1 C77.1 C78.1 C79.1 C80.1 C81.1 C82.1 C83.1 DEBUG.1 imu.P$1(SDO/SA0) imu.P$2(SDX) imu.P$3(SCX) imu.P$6(GND1) imu.P$7(GND2) key0.3 key1.3 left_encoder.4 line_sensor.5 line_sensor.6 line_sensor.7 Q1.2(S) R3.2 R7.2 R8.2 R17.1 reset.3 right_encoder.4 turbine.3 U1.12(VSSA) U1.18(VSS) U1.31(VSS) U1.47(VSS) U1.63(VSS) U8.10(LSS) U8.12(LSS) U8.18(GND) U9.10(LSS) U9.12(LSS) U9.18(GND) U16.4(GND) U17.1(K) U18.2(-) USB1.1(SHELL) USB1.2(SHELL) USB1.3(SHELL) USB1.4(SHELL) USB1.A1B12(GND) USB1.B1A12(GND)
VBAT: accu.2 C11.2 C12.2 C15.1 C16.2 C17.2 C18.2 C21.1 C22.2 C66.2 C67.2 C74.1 C75.1 D1.1(K) R16.2 turbine.2 U8.23(VIN) U8.25(VIN) U9.23(VIN) U9.25(VIN) U16.2(EN) U16.3(VIN)
VBUS: D1.2(A) USB1.A4B9(VBUS) USB1.B4A9(VBUS)
BOOT: boot.1 R3.1 U1.60(BOOT0)
ENC_L_A: left_encoder.2 R10.1 U1.34(PB13)
ENC_L_B: left_encoder.3 R9.1 U1.33(PB12)
ENC_R_A: R11.1 right_encoder.2 U1.52(PC11)
ENC_R_B: R12.1 right_encoder.3 U1.51(PC10)
KEY0: key0.2 U1.27(PB2)
KEY1: key1.2 U1.26(PB1)
L_SCL: U1.11(PC3)
L_SDA: U1.10(PC2)
LE: U1.40(PC9) U8.3(ENA) U8.4(ENB) U8.5(ENC)
LED0: R4.2 U1.25(PB0)
LED1: R5.2 U1.24(PC4)
LED2: R6.2 U1.23(PA7)
LED3: R13.2 U1.14(PA0-WKUP)
LED4: R14.2 U1.15(PA1)
LED5: R15.2 U1.16(PA2)
LS_RESET: line_sensor.4 U1.17(PA3)
LS_SCL: line_sensor.2 U1.20(PA4)
LS_SDA: line_sensor.3 U1.21(PA5)
MLA: C76.2 motor_left.1 U8.9(SA) U8.26(SA)
MLB: C77.2 motor_left.2 U8.11(SB) U8.24(SB)
MLC: C78.2 motor_left.3 U8.13(SC) U8.22(SC)
MRA: C79.2 motor_right.1 U9.9(SA) U9.26(SA)
MRB: C80.2 motor_right.2 U9.11(SB) U9.24(SB)
MRC: C81.2 motor_right.3 U9.13(SC) U9.22(SC)
PLA: U1.37(PC6) U8.6(PWMA)
PLB: U1.38(PC7) U8.7(PWMB)
PLC: U1.39(PC8) U8.8(PWMC)
PRA: U1.58(PB6) U9.6(PWMA)
PRB: U1.59(PB7) U9.7(PWMB)
PRC: U1.61(PB8) U9.8(PWMC)
RE: U1.62(PB9) U9.3(ENA) U9.4(ENB) U9.5(ENC)
RESET: C68.2 DEBUG.4 R2.1 reset.2 U1.7(NRST)
SCL: imu.P$13(SCL) U1.35(PB14)
SDA: imu.P$14(SDA) U1.36(PB15)
SPEAKER: R18.1 U1.22(PA6)
SWCLK: DEBUG.8 U1.49(PA14)
SWDIO: DEBUG.6 U1.46(PA13)
SWO: DEBUG.2 U1.55(PB3)
TPWM: Q1.1(G) R17.2 U1.28(PB10)
UART_RX: DEBUG.3 U1.43(PA10)
UART_TX: DEBUG.5 U1.42(PA9)
USB_DN: U1.44(PA11) USB1.A7(DN1) USB1.B7(DN2)
USB_DP: U1.45(PA12) USB1.A6(DP1) USB1.B6(DP2)
$1N2564: C8.1 U1.30(VCAP_1)
$1N3048: R4.1 U4.2(C)
$1N3052: R5.1 U4.3(C)
$1N3056: R6.1 U4.4(C)
$1N3098: R13.1 U5.2(C)
$1N3100: R14.1 U5.3(C)
$1N3102: R15.1 U5.4(C)
$1N7269: R18.2 U18.1(+)
$1N8342: C83.2 U1.6(PH1-OSC_OUT) X1.1(OSC1)
$1N8350: C82.2 U1.5(PH0-OSC_IN) X1.3(OSC2)
$2N181: Q1.3(D) R16.1 turbine.1
$2N2777: C13.1 U8.21(CP2)
$2N2783: C13.2 U8.20(CP1)
$2N2790: C14.2 U8.14(VG)
$2N2949: C15.2 U8.19(VCP)
$2N3549: C19.1 U9.21(CP2)
$2N3553: C19.2 U9.20(CP1)
$2N3557: C20.2 U9.14(VG)
$2N3560: C21.2 U9.19(VCP)
$3N897: C62.2 U16.6(BST)
$3N898: C62.1 L1.1 U16.5(SW)
$3N1728: R1.1 U17.2(A)
$3N2192: R7.1 USB1.B5(CC2)
$3N2197: R8.1 USB1.A5(CC1)

Not connected (* = marked no-connect by the designer): imu P$4(INT1) P$9(INT2) P$10(NC1) P$11(NC2); key0 1 4; key1 1 4; reset 1 4; U1 1(VBAT) 2(PC13) 3(PC14-OSC32_IN) 4(PC15-OSC32_OUT) 8(PC0) 9(PC1) 29(PB11) 41(PA8) 50(PA15) 53(PC12) 54(PD2) 56(PB4) 57(PB5); U8 1(nFAULT) 15(SOA) 16(SOB) 17(SOC); U9 1(nFAULT) 15(SOA) 16(SOB) 17(SOC); USB1 A8(SBU1) B8(SBU2); X1 2(GND) 4(GND)
